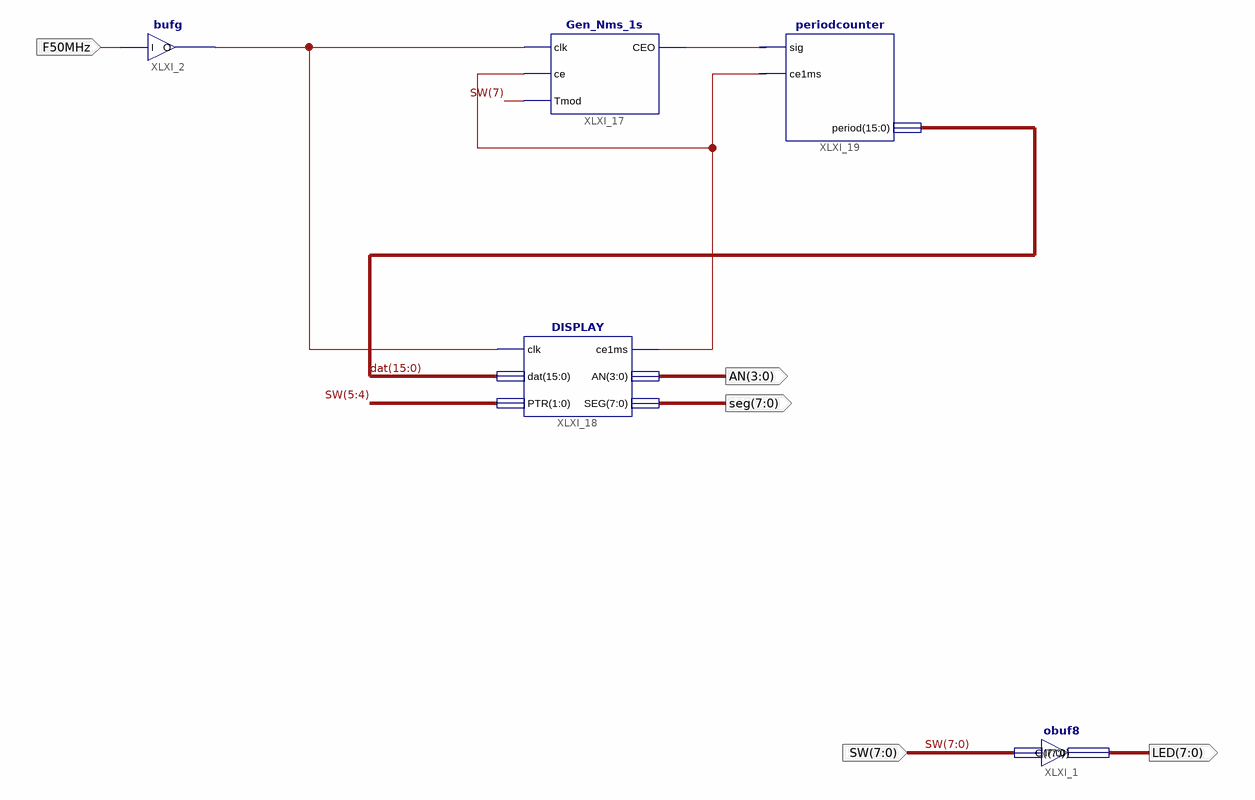
[diagram p0: schematic sheet 1]
// Xilinx ISE schematic signalperiod.sch (spartan3e) as structural Verilog: 5 symbols, 5 ports
module signalperiod (
  input  [7:0] SW,
  input  F50MHz,
  output [7:0] LED,
  output [3:0] AN,
  output [7:0] seg
);

  wire XLXN_17, XLXN_37, XLXN_46;
  wire [15:0] dat;

  obuf8 XLXI_1 (.I(SW), .O(LED));
  Gen_Nms_1s XLXI_17 (.clk(XLXN_37), .ce(XLXN_17), .Tmod(SW[7]), .CEO(XLXN_46));
  DISPLAY XLXI_18 (.clk(XLXN_37), .dat(dat), .PTR(SW[5:4]), .ce1ms(XLXN_17), .AN(AN), .SEG(seg));
  bufg XLXI_2 (.I(F50MHz), .O(XLXN_37));
  periodcounter XLXI_19 (.sig(XLXN_46), .ce1ms(XLXN_17), .period(dat));
endmodule
